# Altium schematic sheet BDAN_PWR.SchDoc
size A4; SheetNumber: 5; SheetTotal: 5
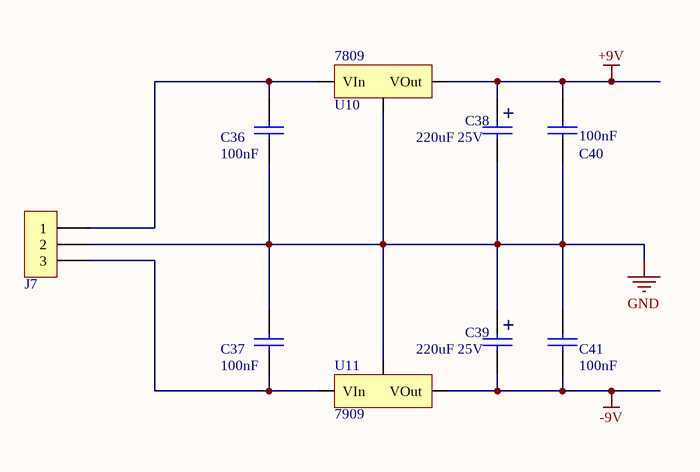
[diagram p0: BDAN_PWR.SchDoc]

## Parts
C36  100nF  [0805]
C37  100nF  [0805]
C38  220uF 25V  [CAP300RP]
C39  220uF 25V  [CAP300RP]
C40  100nF  [0805]
C41  100nF  [0805]
J7  1984620  [BORNERA3_3.5MM]  (value not drawn)
U10  7809  [TO220-V]
U11  7909  [TO220-V]

## Nets
+9V: C38.1 C40.1 U10.3(VOut)
-9V: C39.2 C41.2 U11.3(VOut)
GND: C36.2 C37.1 C38.2 C39.1 C40.2 C41.1 J7.2 U10.2(GND) U11.1(GND)
NetC36_1: C36.1 J7.1 U10.1(VIn)
NetC37_2: C37.2 J7.3 U11.2(VIn)

## Notes on the sheet
- (in symbol CAP_ELECT_220uF_25V) +

## Library data of the parts
C36 C37 C40 C41 = CAP0805_100nF_X7R: CAP0805 100nF X7R; CREO: CP; Part Number: CAP0805_100nF_X7R; Value: 100nF
C38 C39 = CAP_ELECT_220uF_25V: CAP ELECT 220uF 25V; Manufacturer: Nichicon; Manufacturer Part Number: UVR1E221MPD1TA; CREO: MM; Part Number: CAP_ELECT_220uF_25V; Value: 220uF 25V; Supplier 1: Digi-Key; Supplier Part Number 1: 493-6097-3-ND; APROBO: -
J7 = BORNERA_3_3.5MM_TORNILLO: TERM BLK 3P SIDE ENT 3.5MM PCB; Manufacturer: Phoenix Contact; Publico: AP; Part Number: BORNERA_3_3.5MM_TORNILLO; Value: 1984620; Manufacturer Part Number: 1984620; Supplier 1: Digi-Key; Supplier Part Number 1: 277-1722-ND; Aprobo: -
U10 = 7809: IC REG LDO 9V 1.5A TO220; Publico: JP; Part Number: 7809; Value: 7809; Supplier 1: ElectroComponentes
U11 = 7909: IC REG LDO -9V 1.5A TO220; Publico: JP; Part Number: 7909; Value: 7909; Supplier 1: ElectroComponentes